# Altium project modular_connector_adaptor.PrjPcb
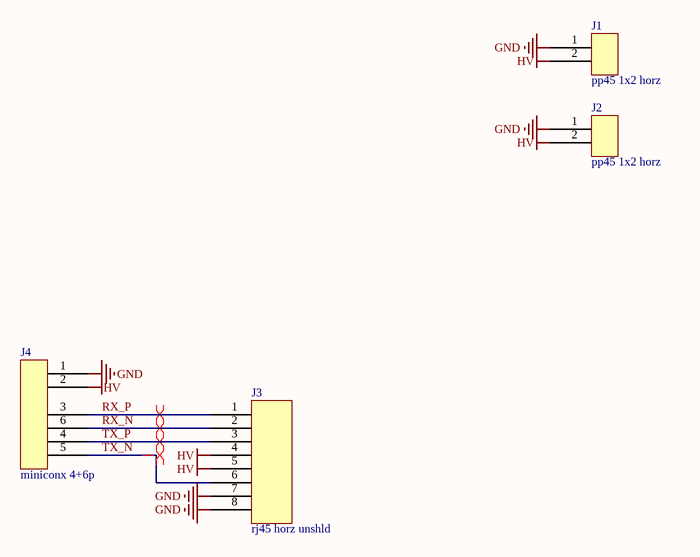
[diagram p0: main.SchDoc]
1 sheet, 4 parts. Net scope: strictly hierarchical (ports join the sheet entries above them; power ports are local).
Board file: main.PcbDoc

## Sheet main.SchDoc
size A

### Parts
J1  pp45 1x2 horz  [CONN PP45 1x2P HORZ]
J2  pp45 1x2 horz  [CONN PP45 1x2P HORZ]
J3  rj45 horz unshld  [CONN RJ45 HORZ UNSHLD]
J4  miniconx 4+6p  [CONN MINICONX 4+2P]

### Nets
GND: J1.1 J2.1 J3.7 J3.8 J4.1
HV: J1.2 J2.2 J3.4 J3.5 J4.2
RX_N: J3.2 J4.6
RX_P: J3.1 J4.3
TX_N: J3.6 J4.5
TX_P: J3.3 J4.4

### Layout directives
differential pair: RX_N, RX_P, TX_N, TX_P

### Library data of the parts
J1 J2 = CONN pp45 1x2 horz: Heavy Duty Power Connectors PCB45 HORIZ (TOP) RA LP CONT.; Manufacturer 1: Anderson Power; Manufacturer Part Number 1: 1337G1; Voltage Rating: 250V; Current Rating: 45A; Gender: Female; Supplier 1: Digi-Key; Category: Connectors; Stock 1: 835; Pricing 1: 1=1.22000, 10=1.07100, 25=1.00800, 50=0.96600, 100=0.92400, 250=0.84000, 500=0.75600, 1000=0.67200, 2500=0.60900 (USD); Mount: Through Hole; Contact Material: Copper; Contact Plating: Tin; Termination: Through Hole; REACH SVHC: No SVHC; ComponentLink1URL: https://datasheet.ciiva.com/18408/70162076-18408970.pdf?src-supplier=Allied+Electronics; ComponentLink1Description: https://datasheet.ciiva.com/18408/70162076-18408970.pdf?src-supplier=Allied+Electronics; ComponentLink2URL: http://datasheet.octopart.com/1337G1-Anderson-Power-datasheet-41191667.pdf?src-supplier=Farnell; ComponentLink2Description: http://datasheet.octopart.com/1337G1-Anderson-Power-datasheet-41191667.pdf?src-supplier=Farnell; ComponentLink3URL: http://datasheet.octopart.com/1337G1-Anderson-Power-datasheet-64289295.pdf?src-supplier=Element14; ComponentLink3Description: http://datasheet.octopart.com/1337G1-Anderson-Power-datasheet-64289295.pdf?src-supplier=Element14; ComponentLink4URL: http://datasheet.octopart.com/1337G1-Anderson-Power-datasheet-9566536.pdf?src-supplier=Allied+Electronics; ComponentLink4Description: http://datasheet.octopart.com/1337G1-Anderson-Power-datasheet-9566536.pdf?src-supplier=Allied+Electronics; ComponentLink5URL: http://datasheet.octopart.com/1337G1-Anderson-Power-datasheet-41232158.pdf?src-supplier=Allied+Electronics; ComponentLink5Description: http://datasheet.octopart.com/1337G1-Anderson-Power-datasheet-41232158.pdf?src-supplier=Allied+Electronics; ComponentLink6URL: http://datasheet.octopart.com/1337G1-Anderson-Power-datasheet-103682810.pdf?src-supplier=Allied+Electronics; ComponentLink6Description: http://datasheet.octopart.com/1337G1-Anderson-Power-datasheet-103682810.pdf?src-supplier=Allied+Electronics; Supplier 2: Digi-Key; Supplier Part Number 1: 2243-1337G1-ND; Supplier Part Number 2: 2243-1336G1-ND
J3 = CONN rj45 horz unshld: CONN MOD JACK 8P8C R/A UNSHLD; Manufacturer 1: Amphenol FCI; Manufacturer Part Number 1: 54602-908LF; Number of Ports: 1; Number of Contacts: 8; Connector Type: Jack,RJ45; Direction: Down; Insulation Resistance: 500MR; Gender: Female; Shielding: Unshielded; Current Rating: 1A; Voltage Rating: 1kV; Contact Resistance: 20mR; Pitch: 2.54mm; Supplier 1: Digi-Key; RoHS: Yes; Category: Modular / Ethernet Connectors; Stock 1: 40515; Pricing 1: 1=0.62000, 10=0.58100, 25=0.52280, 50=0.46460, 100=0.44530, 250=0.40656, 500=0.38720, 1000=0.31944, 2500=0.29040 (USD); Mount: Through Hole; Housing Material: Polyester; Housing Color: Black; Contact Plating: Gold; Contact Material: Copper Alloy,Copper,Bronze; Color: Black; Min Operating Temperature: -40°C; Max Operating Temperature: 70°C; Termination: Through Hole; Orientation: Right Angle; Number of Positions: 8; Number of Positions Loaded: 8; Packaging: Bulk; Package Quantity: 200; Number of Rows: 1; Length: 15.3mm; Width: 15.3mm; Depth: 17.74mm; Radiation Hardening: No; Lead Free: Lead Free; Flammability Rating: UL94 V-0; REACH SVHC: No SVHC; ComponentLink1URL: https://datasheet.ciiva.com/7629/1637015-7629184.pdf?src-supplier=Element14; ComponentLink1Description: https://datasheet.ciiva.com/7629/1637015-7629184.pdf?src-supplier=Element14; ComponentLink2URL: https://datasheet.ciiva.com/685/c-bmj-0102-685432.pdf?src-supplier=Digi-Key; ComponentLink2Description: https://datasheet.ciiva.com/685/c-bmj-0102-685432.pdf?src-supplier=Digi-Key; ComponentLink3URL: https://datasheet.ciiva.com/16945/70236834-16945799.pdf?src-supplier=Allied+Electronics; ComponentLink3Description: https://datasheet.ciiva.com/16945/70236834-16945799.pdf?src-supplier=Allied+Electronics; ComponentLink4URL: https://datasheet.ciiva.com/15170/getdatasheetpartid-177828-15170746.pdf?src-supplier=Verical; ComponentLink4Description: https://datasheet.ciiva.com/15170/getdatasheetpartid-177828-15170746.pdf?src-supplier=Verical; Supplier Part Number 1: 609-1046-ND
J4 = CONN miniconx 4+2p vert: Standard Circular Connector PosLck Pnl Mnt#16#22 PC Cont 6MPins 300; Manufacturer 1: Switchcraft; Manufacturer Part Number 1: W7C81-6PG-P-300; Supplier 1: Digi-Key; Pricing 1: 25=8.98000 (USD); ComponentLink1URL: http://datasheet.octopart.com/W7C81-6PG-P-300-Conxall-datasheet-139885749.pdf?src-supplier=Sager+Electronics; ComponentLink1Description: http://datasheet.octopart.com/W7C81-6PG-P-300-Conxall-datasheet-139885749.pdf?src-supplier=Sager+Electronics; Supplier Part Number 1: 468-W7C81-6PG-P-300-ND